# Altium schematic sheet QCPower Rev A Sht1 Logic Connector.SchDoc
size A3
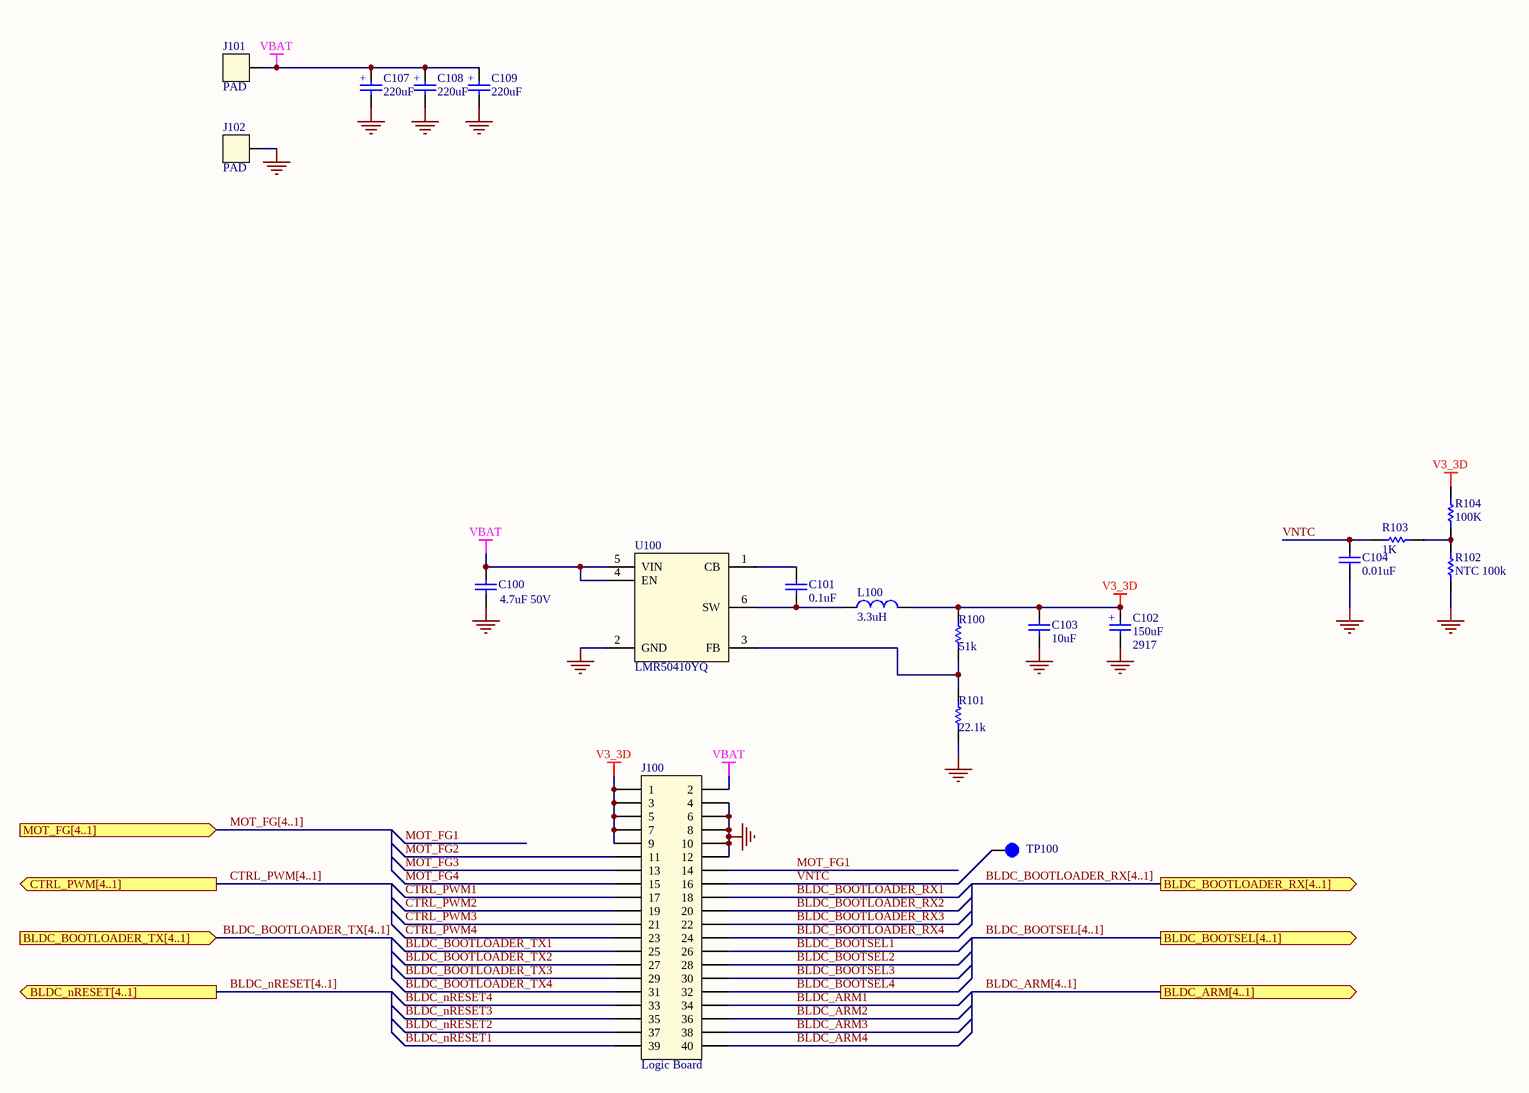
[diagram p0: QCPower Rev A Sht1 Logic Connector.SchDoc]

## Parts
C100  4.7uF 50V  [SMD CAP 0805]
C101  0.1uF  [SMD CAP 0402]
C102  150uF  4. Package: 2917  [SMD CAP TANT 2917]
C103  10uF  [SMD CAP 0805]
C104  0.01uF  [SMD CAP 0402]
C107  220uF  [POLARIZED CAP THROUGH HOLE SIDE MOUNT]
C108  220uF  [POLARIZED CAP THROUGH HOLE SIDE MOUNT]
C109  220uF  [POLARIZED CAP THROUGH HOLE SIDE MOUNT]
J100  Logic Board  [CONN QCOPTER LOGIC Rev A]
J101  PAD  [CONN SOLDER MOTOR]  (no BOM)
J102  PAD  [CONN SOLDER MOTOR]  (no BOM)
L100  3.3uH  [IND SMD 0806]
R100  51k  [SMD RES 0402]
R101  22.1k  [SMD RES 0402]
R102  NTC 100k  [SMD RES 0402]
R103  1K  [SMD RES 0402]
R104  100K  [SMD RES 0402]
TP100  TESTPOINT SMD  [TESTPOINT 1mm DIA]  (value not drawn)  (no BOM)
U100  LMR50410YQ  [SOT-23-6]

## Ports
BLDC_ARM[4..1] (out), BLDC_BOOTLOADER_RX[4..1] (out), BLDC_BOOTLOADER_TX[4..1] (in), BLDC_BOOTSEL[4..1] (out), BLDC_nRESET[4..1] (out), CTRL_PWM[4..1] (out), MOT_FG[4..1] (in)

## Nets
GND: C100.2 C102.2 C103.2 C104.2 C107.2 C108.2 C109.2 J100.4 J100.6 J100.8 J100.10 J100.12 J102.1 R101.2 R102.2 U100.2(GND)
V3_3D: C102.1 C103.1 J100.1 J100.3 J100.5 J100.7 J100.9 L100.2 R100.1 R104.1
VBAT: C100.1 C107.1 C108.1 C109.1 J100.2 J101.1 U100.4(EN) U100.5(VIN)
BLDC_ARM1: J100.34
BLDC_ARM2: J100.36
BLDC_ARM3: J100.38
BLDC_ARM4: J100.40
BLDC_BOOTLOADER_RX1: J100.18
BLDC_BOOTLOADER_RX2: J100.20
BLDC_BOOTLOADER_RX3: J100.22
BLDC_BOOTLOADER_RX4: J100.24
BLDC_BOOTLOADER_TX1: J100.25
BLDC_BOOTLOADER_TX2: J100.27
BLDC_BOOTLOADER_TX3: J100.29
BLDC_BOOTLOADER_TX4: J100.31
BLDC_BOOTSEL1: J100.26
BLDC_BOOTSEL2: J100.28
BLDC_BOOTSEL3: J100.30
BLDC_BOOTSEL4: J100.32
BLDC_nRESET1: J100.39
BLDC_nRESET2: J100.37
BLDC_nRESET3: J100.35
BLDC_nRESET4: J100.33
CTRL_PWM1: J100.17
CTRL_PWM2: J100.19
CTRL_PWM3: J100.21
CTRL_PWM4: J100.23
MOT_FG1: J100.14
MOT_FG2: J100.11
MOT_FG3: J100.13
MOT_FG4: J100.15
VNTC: C104.1 J100.16 R103.2 TP100.1
NetC101_1: C101.1 L100.1 U100.6(SW)
NetC101_2: C101.2 U100.1(CB)
NetR100_2: R100.2 R101.1 U100.3(FB)
NetR102_1: R102.1 R103.1 R104.2

## Buses and harness runs
bus BLDC_ARM[4..1] = port BLDC_ARM[4..1]
bus BLDC_BOOTLOADER_RX[4..1] = port BLDC_BOOTLOADER_RX[4..1]
bus BLDC_BOOTLOADER_TX[4..1] = port BLDC_BOOTLOADER_TX[4..1]
bus BLDC_BOOTSEL[4..1] = port BLDC_BOOTSEL[4..1]
bus BLDC_nRESET[4..1] = port BLDC_nRESET[4..1]
bus CTRL_PWM[4..1] = port CTRL_PWM[4..1]
bus MOT_FG[4..1] = port MOT_FG[4..1]

## Notes on the sheet
- (in symbol CAP POL) +

## Library data of the parts
C100 = CAP MLCC SMD: CAP CER 4.7UF 50V X5R 0805; 1. Manufacturer: Samsung Electro-Mechanics; 2. Manufacturer Part Number: CL21A475KBQNNNE; 4. Package: 0805; 3. Date Modified: 20201125
C101 = CAP MLCC SMD: CAP CER 0.1UF 25V X7R 0402; 1. Manufacturer: Yageo; 2. Manufacturer Part Number: CC0402KRX7R8BB104; 4. Package: 0402; 3. Date Modified: 20201122
C102 = CAP POL: CAP TANT 150UF 10% 10V 2917; 1. Manufacturer: KEMET; 2. Manufacturer Part Number: T495D157K010ATE100; 3. Date Modified: 20200910
C103 = CAP MLCC SMD: CAP CER 10UF 25V X5R 0805; 1. Manufacturer: Taiyo Yuden; 2. Manufacturer Part Number: TMK212BBJ106KG-T; 4. Package: 0805; 3. Date Modified: 20201219
C104 = CAP MLCC SMD: CAP CER 10000PF 16V X7R 0402; 1. Manufacturer: Walsin Technology Corporation; 2. Manufacturer Part Number: 0402B103K160CT; 4. Package: 0402; 3. Date Modified: 20201122
C107 C109 = CAP POL: CAP ALUM 220UF 20% 63V RADIAL; 1. Manufacturer: Nichicon; 2. Manufacturer Part Number: UCD1J221MNQ1MS; 3. Date Modified: 20201128; 4. Package: *
C108 = CAP POL: CAP ALUM 220UF 20% 63V RADIAL; 1. Manufacturer: Panasonic Electronic Components; 2. Manufacturer Part Number: ECA-1JM221; 3. Date Modified: 20201204; 4. Package: *
J100 = CONN QCOPTER LOGIC REV A: 1. Manufacturer: Amphenol ICC (FCI); 2. Manufacturer Part Number: ‎10144518-041802LF‎; 3. Date Modified: 20201203
J101 J102 = CONN SOLDER MOTOR 7x5: 1. Manufacturer: *; 2. Manufacturer Part Number: *; 3. Date Modified: *
L100 = INDUCTOR: FIXED IND 3.3UH 1.2A 150 MOHM; 1. Manufacturer: Murata Electronics; 2. Manufacturer Part Number: LQM2MPN3R3NG0L; 3. Date Modified: 20201126
R100 = RES SMD: RES SMD 51K OHM 1% 1/16W 0402; 1. Manufacturer: Yageo; 2. Manufacturer Part Number: RC0402FR-0751KL; 4. Package: 0402; 3. Date Modified: 20201126
R101 = RES SMD: RES SMD 22.1K OHM 1% 1/16W 0402; 1. Manufacturer: Yageo; 2. Manufacturer Part Number: RC0402FR-0722K1L; 4. Package: 0402; 3. Date Modified: 20201126
R102 = RES SMD: NTC,100K,1%,0402,AEC-Q200,EPOXY; 1. Manufacturer: TDK Corporation; 2. Manufacturer Part Number: NTCSP104KF104FT1S; 4. Package: 0402; 3. Date Modified: 20201220
R103 = RES SMD: RES SMD 1K OHM 1% 1/16W 0402; 1. Manufacturer: Yageo; 2. Manufacturer Part Number: RC0402FR-071KL; 4. Package: 0402; 3. Date Modified: 20201122
R104 = RES SMD: RES SMD 100K OHM 1% 1/16W 0402; 1. Manufacturer: Yageo; 2. Manufacturer Part Number: RC0402FR-07100KL; 4. Package: 0402; 3. Date Modified: 20201128
TP100 = TESTPOINT PAD: TESTPOINT SMD PAD; 1. Manufacturer: *; 2. Manufacturer Part Number: *; 3. Date Modified: *
U100 = IC REG BUCK 1A SOT-23-6: 1. Manufacturer: Texas Instruments; 2. Manufacturer Part Number: LMR50410YQDBVRQ1; 3. Date Modified: 20201126